# Altium schematic sheet System_Block_Diagram.SchDoc: System Block Diagram
size 279 x 241 mm; DrawnBy: FitC Engineers; DocumentNumber: 1; Revision: 1; SheetNumber: 1; SheetTotal: 5
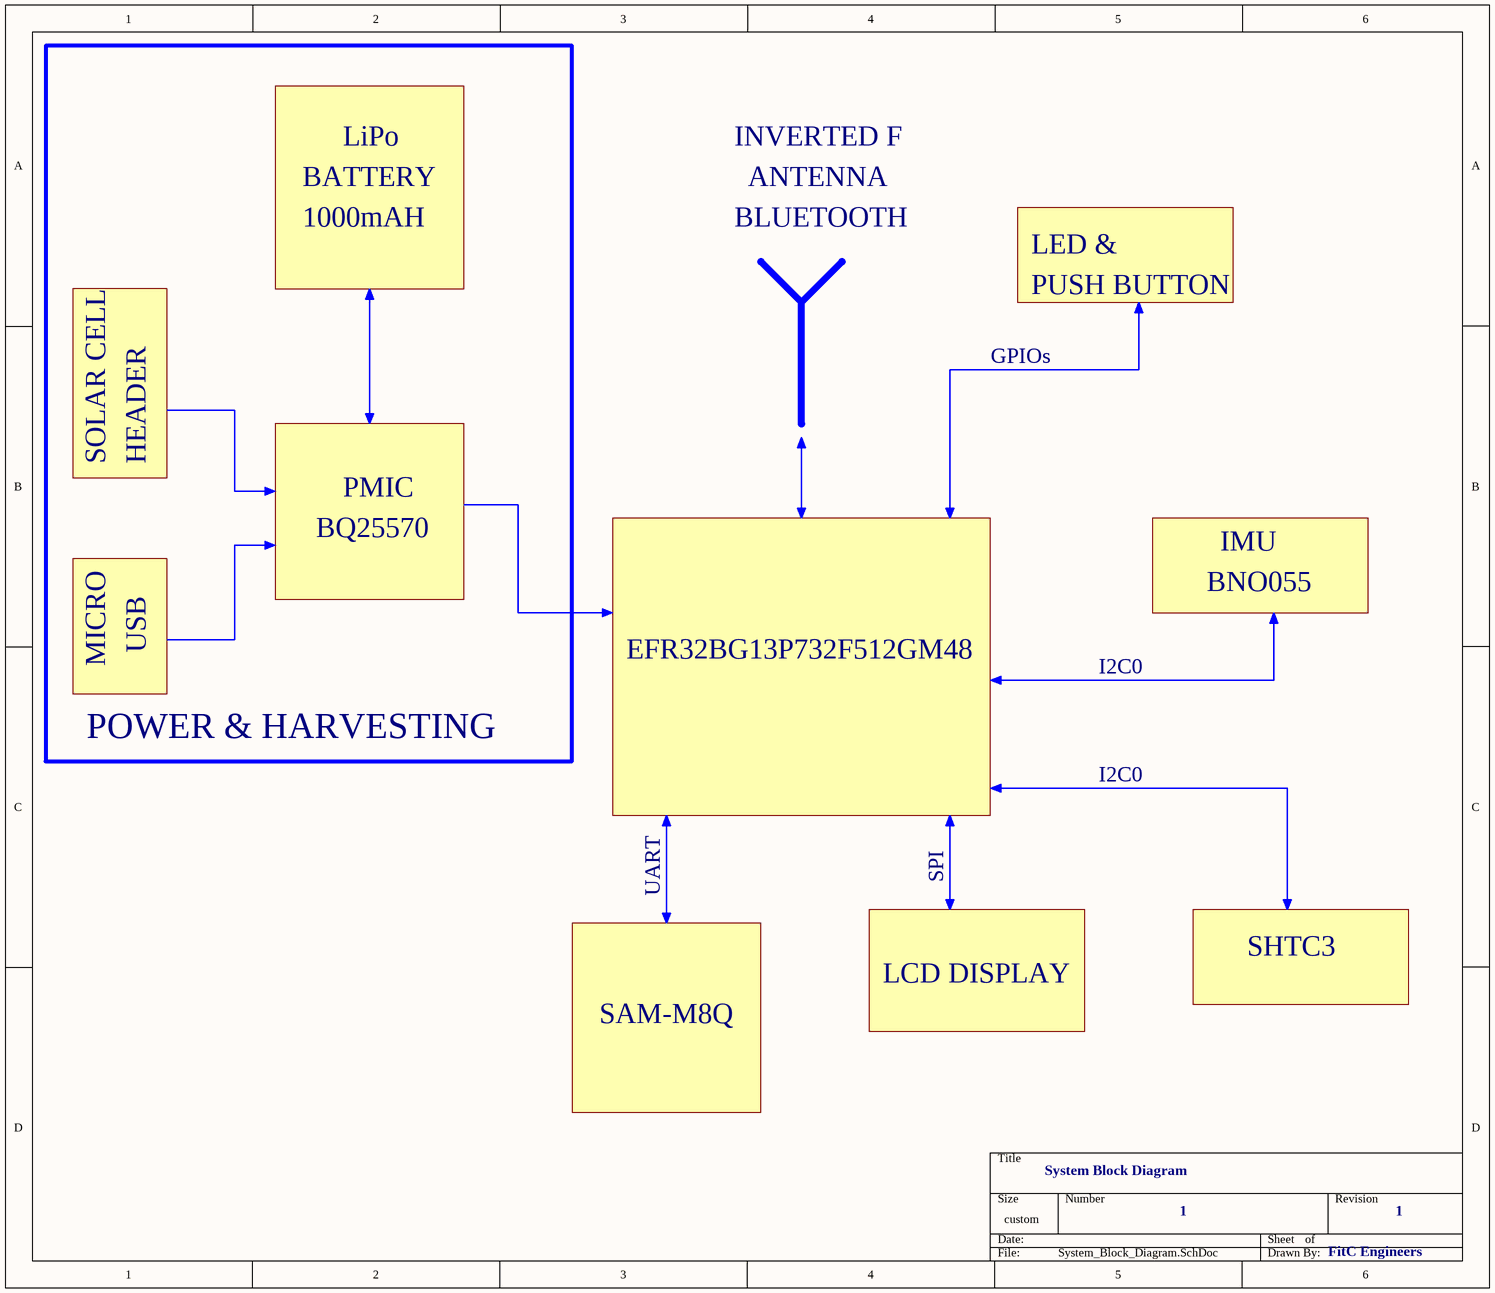
[diagram p0: System_Block_Diagram.SchDoc]

## Notes on the sheet
- LiPo
- INVERTED F
- BATTERY
- 1000mAH
- BLUETOOTH
- ANTENNA
- LED &
- PUSH BUTTON
- GPIOs
- SOLAR CELL
- HEADER
- PMIC
- BQ25570
- IMU
- BNO055
- MICRO
- USB
- EFR32BG13P732F512GM48
- I2C0
- POWER & HARVESTING
- UART
- SPI
- SHTC3
- SAM-M8Q
- LCD DISPLAY